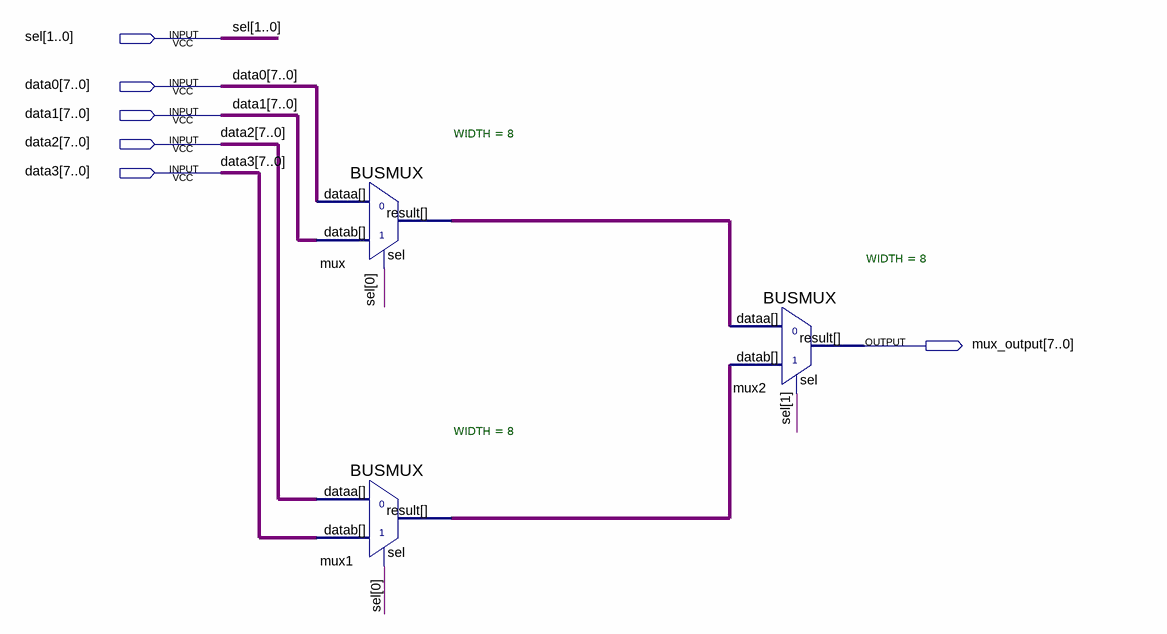
[diagram p0: schematic sheet]
// Quartus schematic mux_4.bdf as structural Verilog: 3 symbols, 6 pins
module mux_4 (
  input  [1:0] sel,
  input  [7:0] data0,
  input  [7:0] data1,
  input  [7:0] data2,
  input  [7:0] data3,
  output [7:0] mux_output
);

  wire [7:0] mux1_result, mux_result;

  BUSMUX #(.WIDTH(8)) mux (.datab(data1), .sel(sel[0]), .dataa(data0), .result(mux_result));
  BUSMUX #(.WIDTH(8)) mux1 (.datab(data3), .sel(sel[0]), .dataa(data2), .result(mux1_result));
  BUSMUX #(.WIDTH(8)) mux2 (.datab(mux1_result), .sel(sel[1]), .dataa(mux_result), .result(mux_output));
endmodule
